# Altium schematic sheet Lab1_Konovalov_USB_RS485.SchDoc: =title_line_1 + title_line_2
size 594 x 420 mm; SheetNumber: n
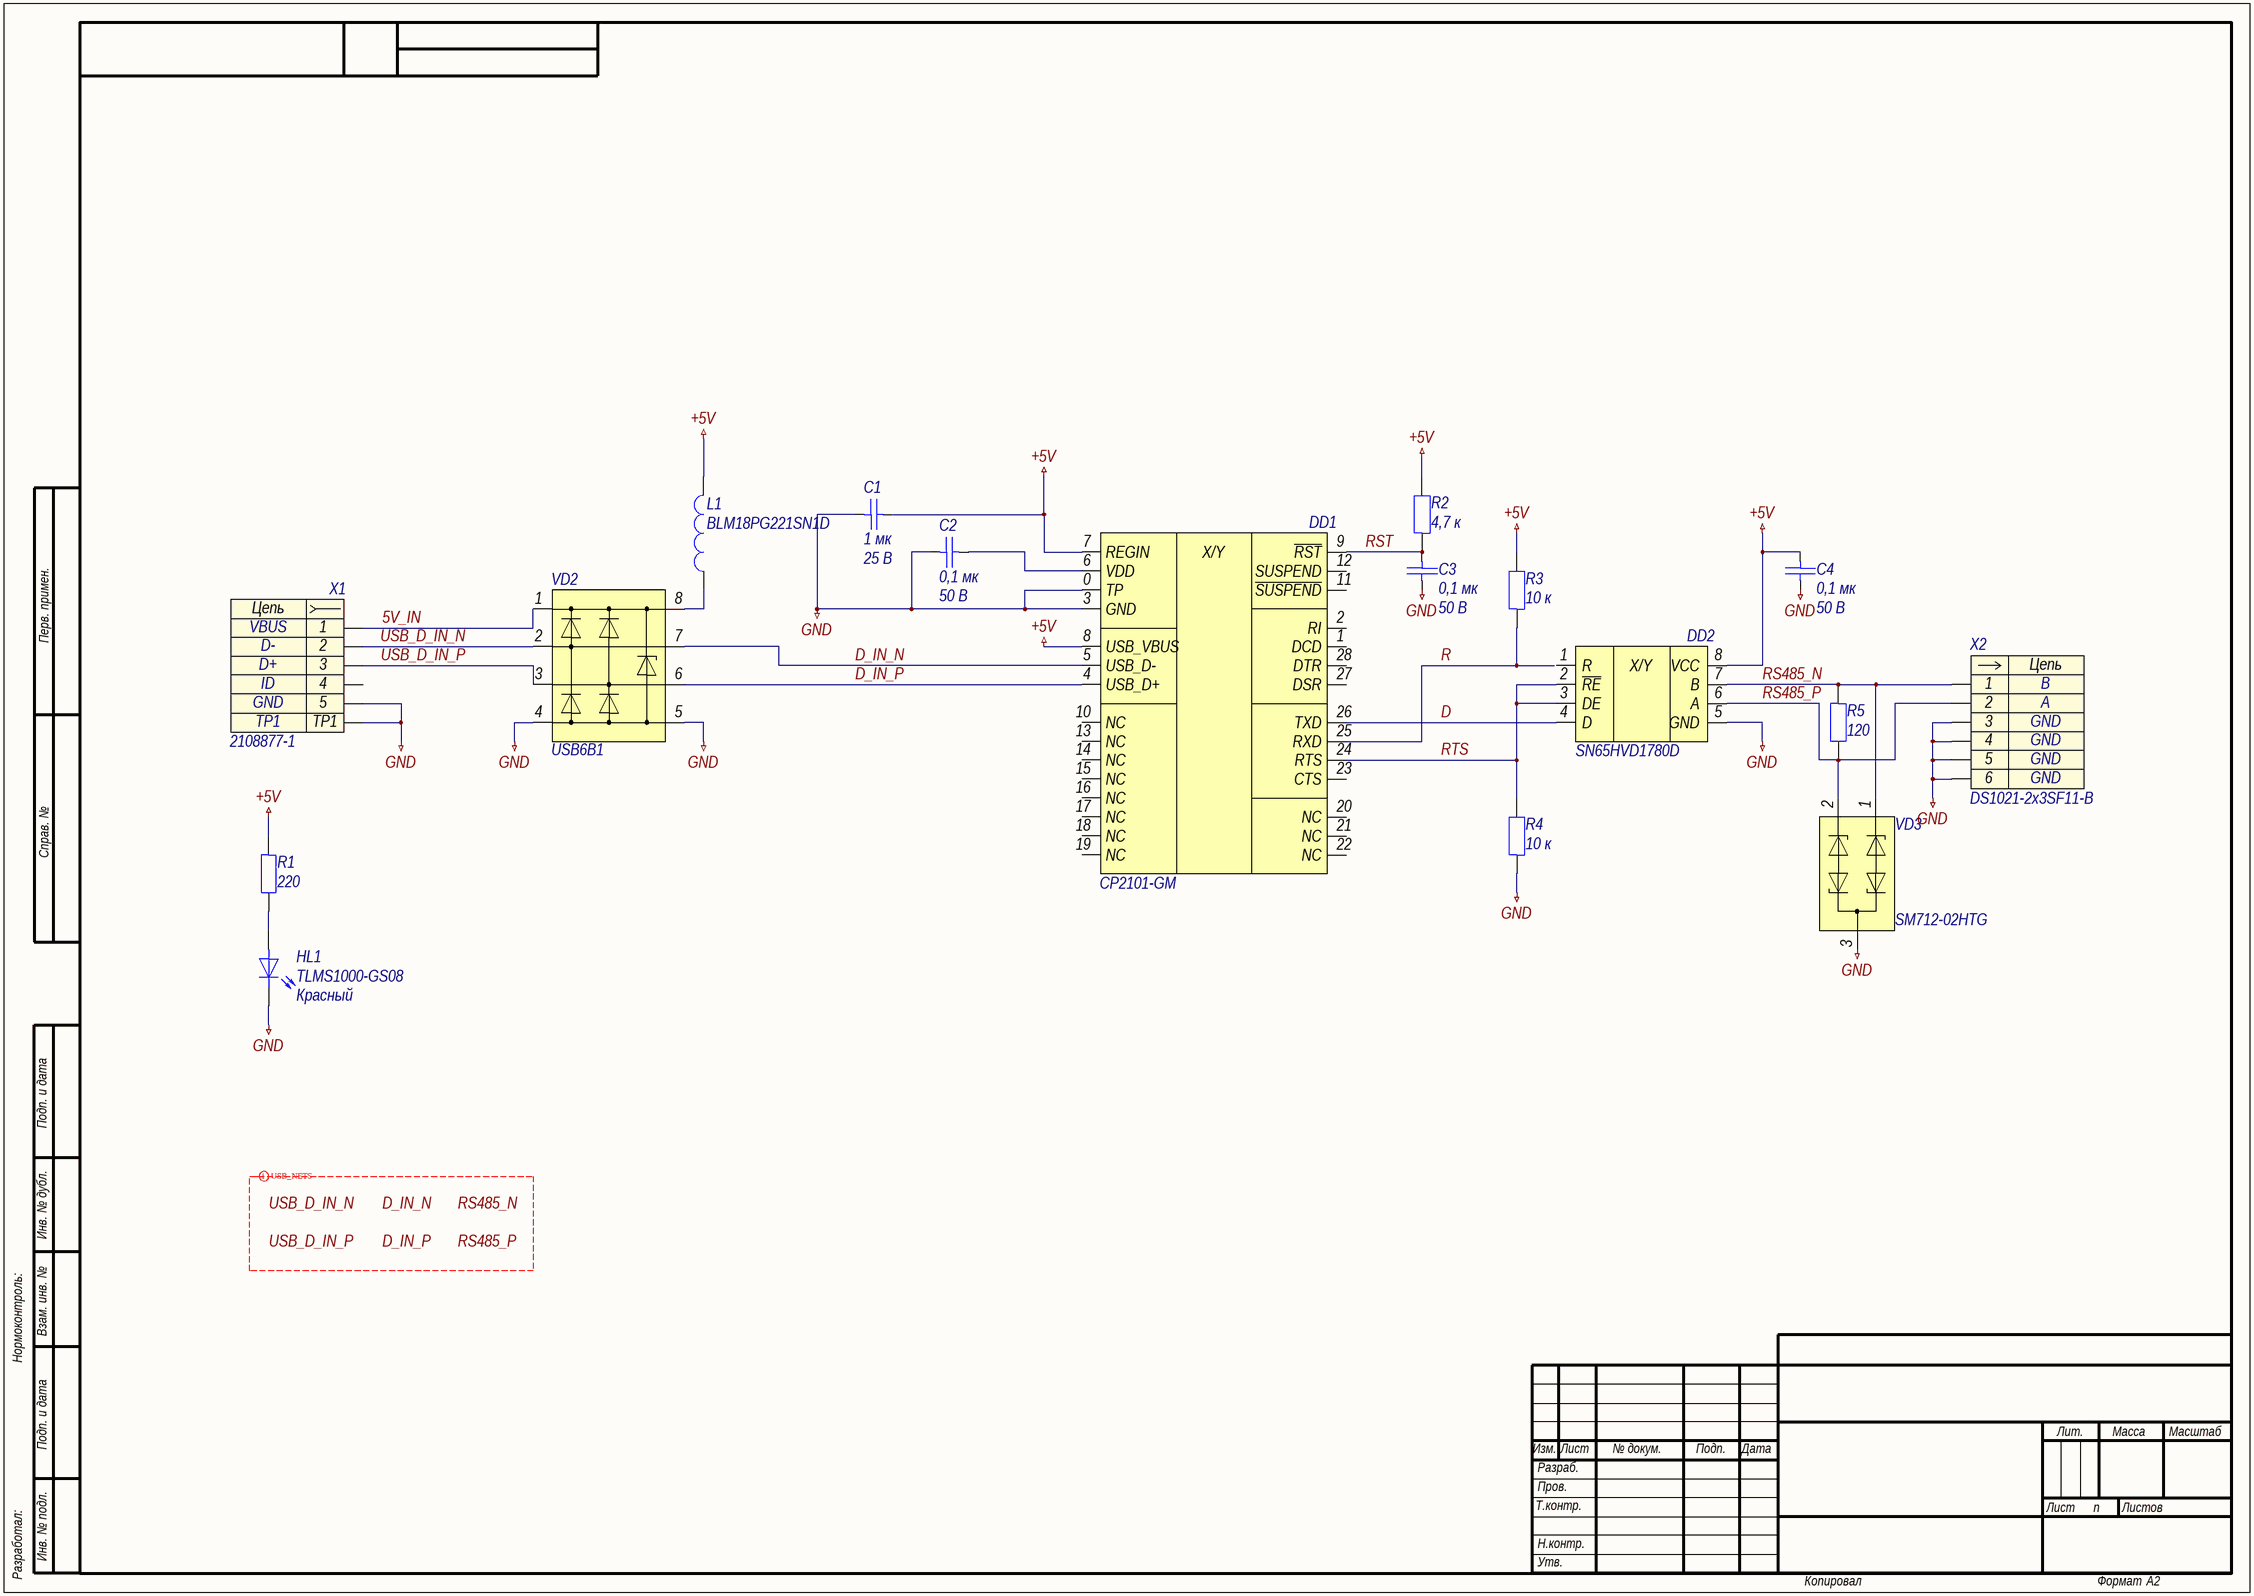
[diagram p0: Lab1_Konovalov_USB_RS485.SchDoc]

## Parts
C1  1 мк  Напряжение: 25 В  [C0603]
C2  0,1 мк  Напряжение: 50 В  [C0603]
C3  0,1 мк  Напряжение: 50 В  [C0603]
C4  0,1 мк  Напряжение: 50 В  [C0603]
DD1  CP2101-GM  [QFN-28-500X500X90]
DD2  SN65HVD1780D  [SOIC-8]
HL1  TLMS1000-GS08  Colour: Красный  [HL0603]
L1  BLM18PG221SN1D  [BLM-2-0603]
R1  220  [R0603]
R2  4,7 к  [R0603]
R3  10 к  [R0603]
R4  10 к  [R0603]
R5  120  [R0603]
VD2  USB6B1  [SO-8]
VD3  SM712-02HTG  [SOT23-3]
X1  2108877-1  [2108877-1]
X2  DS1021-2x3SF11-B  [DS1021-2X3SF11-B]

## Nets
+5V: C1.1 C4.2 DD1.7(REGIN) DD1.8(USB_VBUS) DD2.8(VCC) L1.2 R1.1 R2.2 R3.2
GND: C1.2 C2.2 C3.1 C4.1 DD1.0(TP) DD1.3(GND) DD2.5(GND) HL1.1 R4.1 VD2.4 VD2.5 VD3.3 X1.5 X1.TP1 X2.3 X2.4 X2.5 X2.6
5V_IN: VD2.1 X1.1
D: DD1.26(TXD) DD2.4(D)
D_IN_N: DD1.5(USB_D-) VD2.7
D_IN_P: DD1.4(USB_D+) VD2.6
R: DD1.25(RXD) R3.1
RS485_N: DD2.7(B) R5.1 VD3.1 X2.1
RS485_P: DD2.6(A) R5.2 VD3.2 X2.2
RST: C3.2 DD1.9(~{RST}) R2.1
RTS: DD1.24(RTS) DD2.2(~{RE}) DD2.3(DE) R4.2
USB_D_IN_N: VD2.2 X1.2
USB_D_IN_P: VD2.3 X1.3
NetC2_1: C2.1 DD1.6(VDD)
NetHL1_2: HL1.2 R1.2
NetL1_1: L1.1 VD2.8

Not connected (* = marked no-connect by the designer): DD1 1(DCD) 2(RI) 10(NC) 11(~{SUSPEND}) 12(SUSPEND) 13(NC) 14(NC) 15(NC) 16(NC) 17(NC) 18(NC) 19(NC) 20(NC) 21(NC) 22(NC) 23(CTS) 27(DSR) 28(DTR); DD2 1(R); X1 4

## Layout directives
differential pair; rule Differential Pairs Routing [Pref Gap = 0.65mm    Min Gap  = 0.254mm    Max Gap  = 0.65mmPref Width = 0.381mm    Min Width  = 0.125mm    Max Width  = 0.381mm]; differential pair class USB_SIGNALS: D_IN_N, D_IN_P, RS485_N, RS485_P, USB_D_IN_N, USB_D_IN_P

## Notes on the sheet
- Labels drawn without touching a wire or pin: D_IN_N, D_IN_P, RS485_N, RS485_P, USB_D_IN_N, USB_D_IN_P
- Перв. примен.
- Справ. №
- Подп. и дата
- Инв. № дубл.
- Нормоконтроль:
- Взам. инв. №
- Изм.
- Лист
- № докум.
- Подп.
- Дата
- Лит.
- Масса
- Масштаб
- Т.контр.
- Пров.
- Разраб.
- Листов
- Разработал:
- Инв. № подл.
- Н.контр.
- Утв.
- Копировал
- Формат
- А2
- (in symbol dd0002) X/Y
- (in symbol dd0014) X/Y
- (in symbol x0001) Цепь
- (in symbol x0015) Цепь

## Library data of the parts
C1 = c0022: =Описание; ID: c0022; Фамилия: Ларионов; Описание: Конденсатор чип 0603 1 мкФ 25 В ±10 %; Наименование: CC0603KRX7R8BB105; Производитель: YAGEO Corp.; Отклонение: ±10 %; Рабочие температуры: от -55 °С до +125 °С; Корпус: 0603; Номинал: 1 мк; Номинальное напряжение: 25 В; HelpURL: https://www.yageo.com/upload/media/product/products/datasheet/mlcc/UPY-GPHC_X7R_6.3V-to-50V_20.pdf
C2-C4 = c0018: =Описание; ID: c0018; Фамилия: Ларионов; Описание: Конденсатор чип 0603 0,1 мкФ 50 В ±5 %; Наименование: CC0603JRX7R9BB104; Производитель: YAGEO Corp.; Отклонение: ±5 %; Рабочие температуры: от -55 °С до +125 °С; Корпус: 0603; Номинал: 0,1 мк; Номинальное напряжение: 50 В; HelpURL: https://www.yageo.com/upload/media/product/products/datasheet/mlcc/UPY-GPHC_X7R_6.3V-to-50V_20.pdf
DD1 = dd0002: =Описание; ID: dd0002; Фамилия: Коновалов; Описание: Преобразователь USB-UART; Производитель: Silicon Laboratories; Корпус: QFN-28; Наименование: CP2101-GM; HelpURL: https://www.silabs.com/interface/usb-bridges/classic/device.cp2101
DD2 = dd0014: =Описание; ID: dd0014; Фамилия: Коновалов; Описание: Приемопередатчик RS-485; Производитель: Texas Instruments; Наименование: SN65HVD1780D; Корпус: SOIC-8; HelpURL: https://www.ti.com/product/SN65HVD1780
HL1 = hl0001: =Описание; ID: hl0001; Фамилия: Ларионов; Описание: Светодиод чип 0603 красный; Производитель: Vishay Intertechnology, Inc.; Номинальная сила света: 4 мкд; Номинальная длина волны: 628 нм; Номинальный прямой ток: 15 мА; Номинальное падение напряжения: 1,8 В; Рассеиваемая мощность: 40 мВт; Рабочие температуры: от –40 °С до +100 °С; Корпус: 0603; Наименование: TLMS1000-GS08; Цвет: Красный; HelpURL: https://www.vishay.com/leds/list/product-83172/
L1 = l0002: =Описание; ID: l0002; Фамилия: Самарин; Описание: Ферритовая бусина 220 Ом ±25 %; Производитель: Murata Manufacturing Co., Ltd.; Сопротивление, 100 МГц: 220 Ом; Отклонение, 100 Мгц: ±25 %; Сопротивление при постоянном токе: 0,1 Ом; Рабочие температуры: от -55 °С до +125 °С; Корпус: 0603; Наименование: BLM18PG221SN1D; HelpURL: https://www.murata.com/en-global/products/productdetail?partno=BLM18PG221SN1%23
R1 = r0009: =Описание; ID: r0009; Фамилия: Ларионов; Описание: Резистор чип 0603 220 Ом ±1 % 0,1 Вт; Наименование: RC0603FR-07220RL; Производитель: YAGEO Corp.; Отклонение: ±1 %; Номинальное напряжение: 75 В; Рабочие температуры: от -55 °С до +155 °С; Номинальный ток: 1 А; Корпус: 0603; Номинал: 220; HelpURL: https://www.yageo.com/upload/media/product/productsearch/datasheet/rchip/PYu-RC_Group_51_RoHS_L_11.pdf
R2 = r0029: =Описание; ID: r0029; Фамилия: Ларионов; Описание: Резистор чип 0603 4,7 кОм ±1 % 0,1 Вт; Наименование: RC0603FR-074K7L; Производитель: YAGEO Corp.; Отклонение: ±1 %; Номинальное напряжение: 75 В; Рабочие температуры: от -55 °С до +155 °С; Номинальный ток: 1 А; Корпус: 0603; Номинал: 4,7 к; HelpURL: https://www.yageo.com/upload/media/product/productsearch/datasheet/rchip/PYu-RC_Group_51_RoHS_L_11.pdf
R3 R4 = r0040: =Описание; ID: r0040; Фамилия: Самарин; Описание: Резистор чип 0603 10 кОм ±1 % 0,1 Вт; Наименование: RC0603FR-0710KL; Производитель: YAGEO Corp.; Отклонение: ±1 %; Номинальное напряжение: 75 В; Рабочие температуры: от -55 °С до +155 °С; Номинальный ток: 1 А; Корпус: 0603; Номинал: 10 к; HelpURL: https://www.yageo.com/upload/media/product/productsearch/datasheet/rchip/PYu-RC_Group_51_RoHS_L_11.pdf
R5 = r0008: =Описание; ID: r0008; Фамилия: Самарин; Описание: Резистор чип 0603 120 Ом ±1 % 0,1 Вт; Наименование: RC0603FR‍‐07120RL; Производитель: YAGEO Corp.; Отклонение: ±1 %; Номинальное напряжение: 75 В; Рабочие температуры: от -55 °С до +155 °С; Номинальный ток: 1 А; Корпус: 0603; Номинал: 120; HelpURL: https://www.yageo.com/upload/media/product/productsearch/datasheet/rchip/PYu-RC_Group_51_RoHS_L_11.pdf
VD2 = vd0006: =Описание; ID: vd0006; Фамилия: Ларионов; Описание: Диодная сборка для подавления помех, от 6 В; Производитель: STMicroelectronics; Наименование: USB6B1; Корпус: SO-8; HelpURL: https://www.st.com/content/st_com/en/products/protection-devices/esd-protection/usb-port-protection/usb6b1.html
VD3 = vd0003: =Описание; ID: vd0003; Фамилия: Самарин; Описание: Диодная сборка для подавления помех, -7/12 В; Производитель: Littelfuse, Inc.; Наименование: SM712-02HTG; Корпус: SOT23-3; HelpURL: https://www.littelfuse.com/products/tvs-diode-arrays/general-purpose-esd-protection/sm712.aspx
X1 = x0001: =Описание; Contact_1: VBUS; Contact_2: D-; Contact_3: D+; Contact_4: ID; Contact_5: GND; ID: x0001; Фамилия: Ларионов; Описание: Micro USB 2.0 Type B IP68 гнездо; Производитель: TE Connectivity; Наименование: 2108877-1; HelpURL: https://www.te.com/global-en/product-2108877-1.html
X2 = x0015: =Описание; Contact_1: B; Contact_2: A; Contact_3: GND; ID: x0015; Фамилия: Самарин; Описание: PLS 2x3 pin 2,54 мм вилка прямой; Производитель: Connfly Electronic Co., Ltd.; Contact_4: GND; Contact_5: GND; Contact_6: GND; Наименование: DS1021-2x3SF11-B; HelpURL: http://en.connfly.group/product/xVkr=EusQssAN0gN=Aos=mU+UrVkR9kqEAN0gN9g+WqANB+A